# Altium schematic sheet OZ440-SE140-CAR001_sheet1.SchDoc: Carte securité: TOP LEVEL
size A3; Author: Bruno MATHIEU; CompanyName: NAIO TECHNOLOGIES; DrawnBy: Bruno MATHIEU; Engineer: Bruno MATHIEU; DocumentNumber: OZ440-SE140-CAR001-SHEET1; Revision: 1; SheetNumber: 1; SheetTotal: 6; CurrentDate: 27/11/14; DocumentName: Carte securité: TOP LEVEL
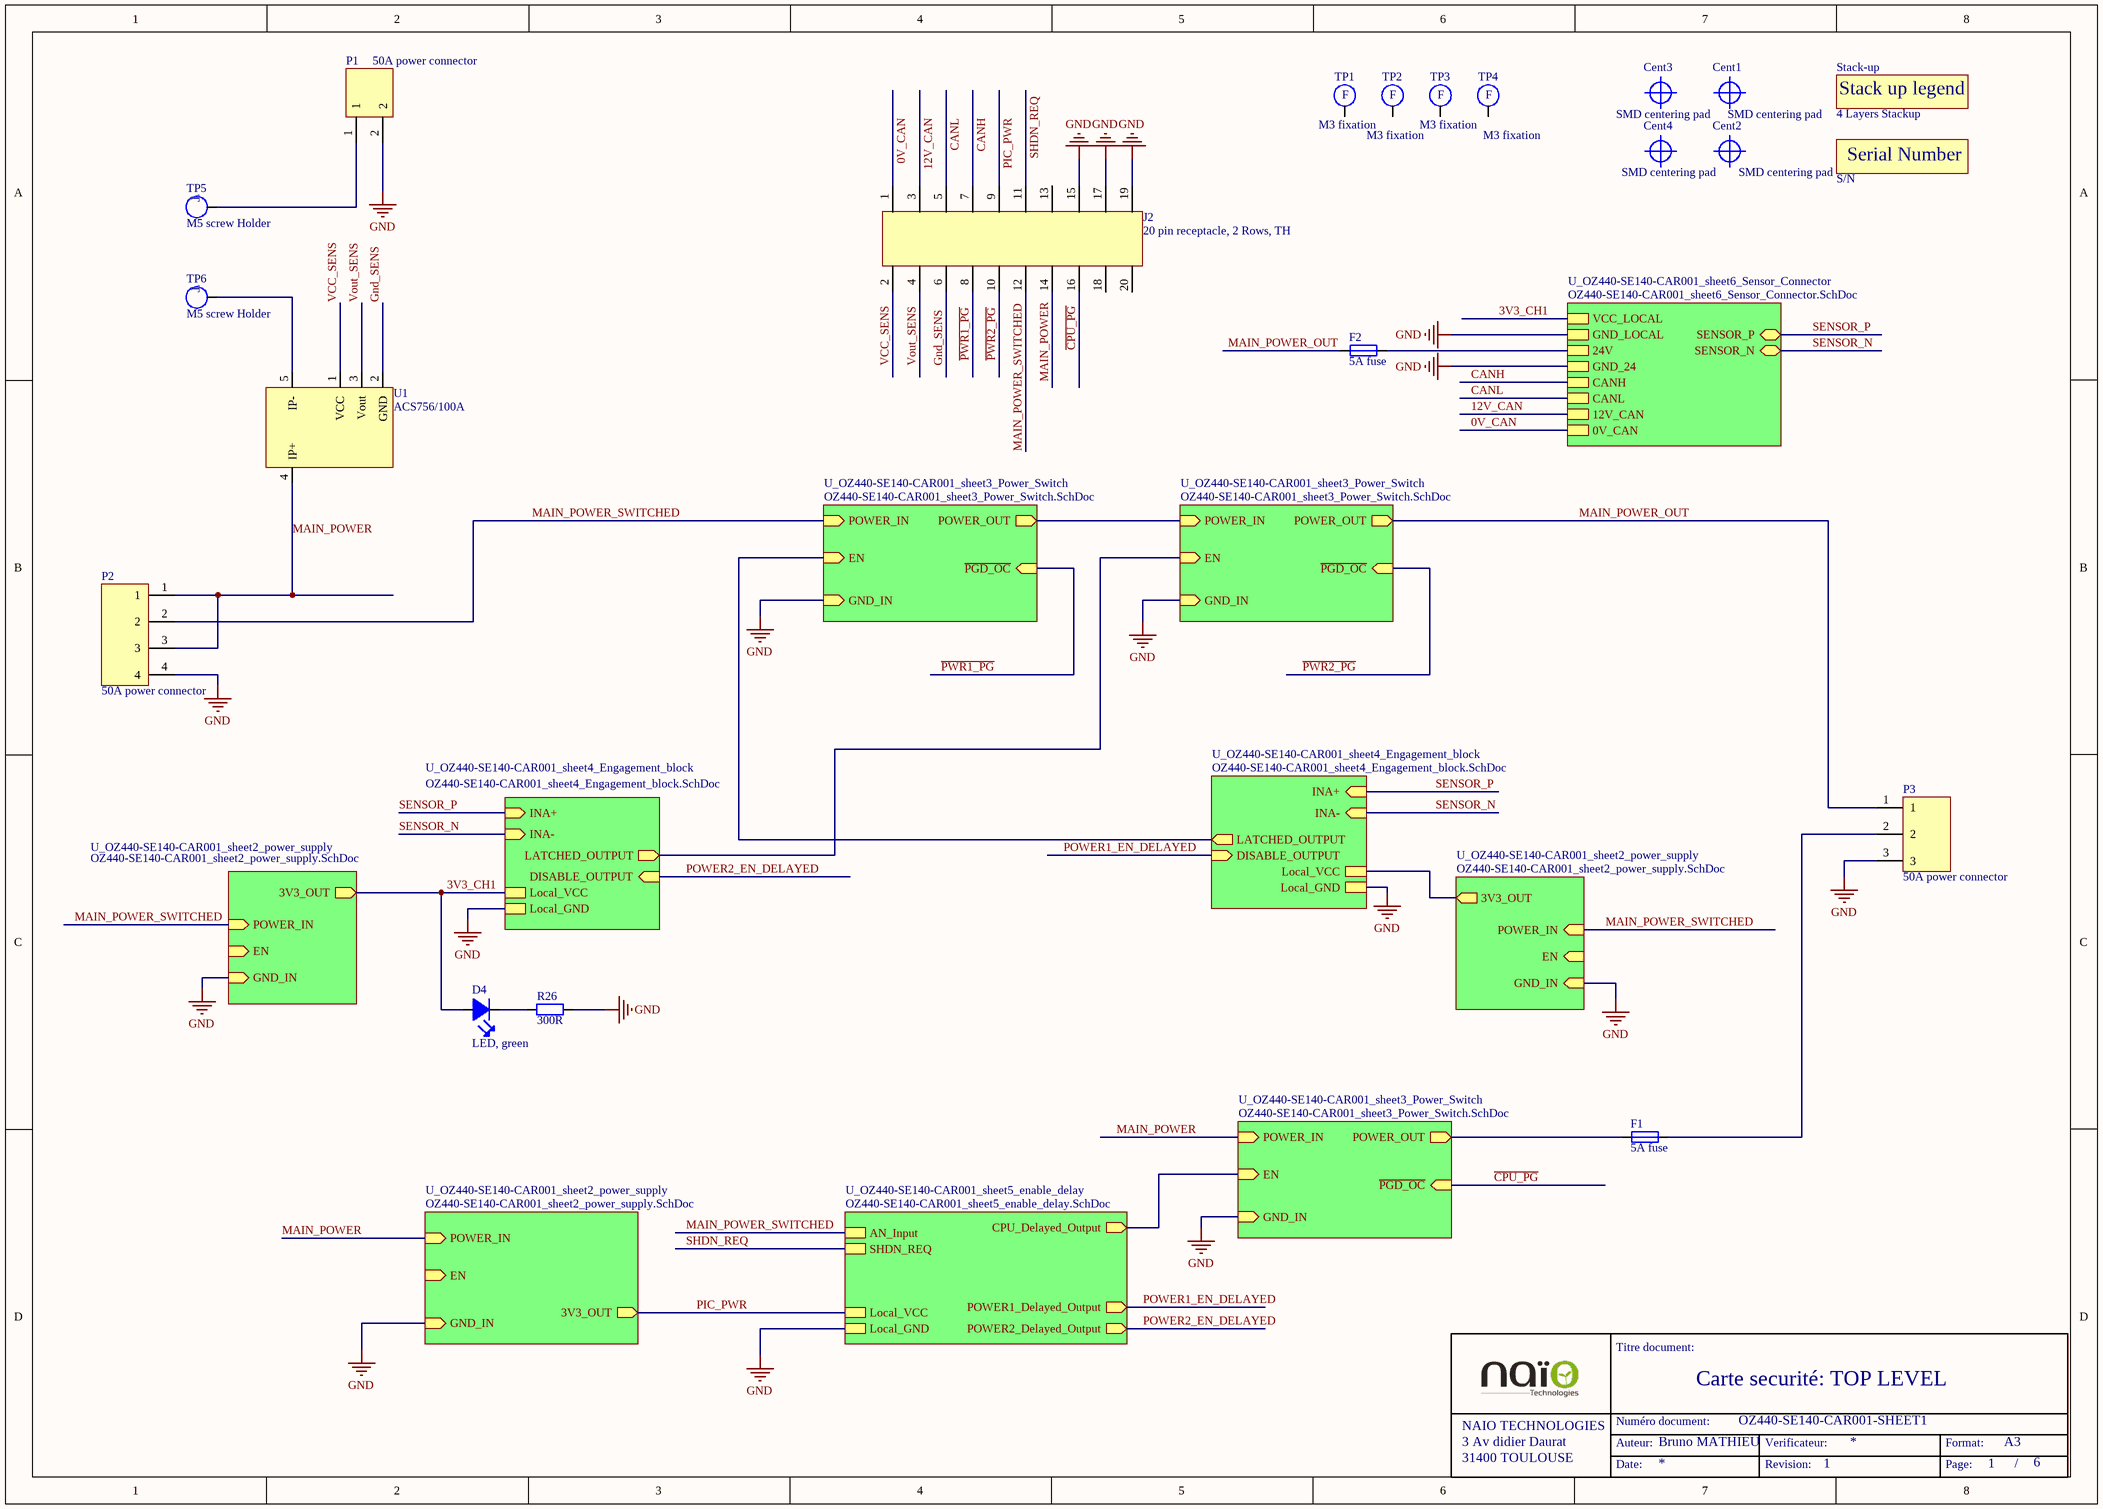
[diagram p0: OZ440-SE140-CAR001_sheet1.SchDoc]

## Parts
Cent1  MEC-STD-CENTER  [MEC-STD-CENTER]  (value not drawn)  (no BOM)
Cent2  MEC-STD-CENTER  [MEC-STD-CENTER]  (value not drawn)  (no BOM)
Cent3  MEC-STD-CENTER  [MEC-STD-CENTER]  (value not drawn)  (no BOM)
Cent4  MEC-STD-CENTER  [MEC-STD-CENTER]  (value not drawn)  (no BOM)
D4  Displayed reference: LED, green  [LED_3MM]  (hidden comment: LED)  (no BOM)
F1  Displayed reference: 5A fuse  [F-SPE-154Series_littlefuse]  (hidden comment: FUSE-SMD)
F2  Displayed reference: 5A fuse  [F-SPE-154Series_littlefuse]  (hidden comment: FUSE-SMD)
J2  Displayed reference: 20 pin receptacle, 2 Rows, TH  [CONN-SPE_ESQ-110-12-G-D]  (hidden comment: CONN-STD-20P_2ROW)
P1  Displayed reference: 50A power connector  [CONN-SPE-428192213_MOLEX]  (hidden comment: CONN-STD-2P_puissance)
P2  Displayed reference: 50A power connector  [CONN-SPE-428194213_MOLEX]  (hidden comment: CONN-STD-4P_puissance)
P3  Displayed reference: 50A power connector  [CONN-SPE-428193213_MOLEX]  (hidden comment: CONN-STD-3P_puissance)
R26  Displayed reference: 300R  [R0805-STD]  (hidden comment: RES-SMD)
SN  Displayed reference: S/N  [SERIAL_NUMBER-STD]  (hidden comment: SERIAL-NUMBER)  (no BOM)
Stack-up  Displayed reference: 4 Layers Stackup  [STACKUP-SPE-4LAYERS]  (hidden comment: STACKUP)  (no BOM)
TP1  Displayed reference: M3 fixation  [MEC-STD-FIX_M3]  (hidden comment: FIX-STD-PCB_FIXATION)  (no BOM)
TP2  Displayed reference: M3 fixation  [MEC-STD-FIX_M3]  (hidden comment: FIX-STD-PCB_FIXATION)  (no BOM)
TP3  Displayed reference: M3 fixation  [MEC-STD-FIX_M3]  (hidden comment: FIX-STD-PCB_FIXATION)  (no BOM)
TP4  Displayed reference: M3 fixation  [MEC-STD-FIX_M3]  (hidden comment: FIX-STD-PCB_FIXATION)  (no BOM)
TP5  Displayed reference: M5 screw Holder  [MEC-SPE-WURTHZ_7460408]  (hidden comment: TP-STD-TEST_POINT)
TP6  Displayed reference: M5 screw Holder  [MEC-SPE-WURTHZ_7460408]  (hidden comment: TP-STD-TEST_POINT)
U1  Displayed reference: ACS756/100A  [CA_PFF-SPE-ACS756]  (hidden comment: ACS756-CA_PFF)

## Sub-sheets
U_OZ440-SE140-CAR001_sheet2_power_supply = OZ440-SE140-CAR001_sheet2_power_supply.SchDoc: EN (in), POWER_IN (in), GND_IN (in), 3V3_OUT (out)
U_OZ440-SE140-CAR001_sheet2_power_supply = OZ440-SE140-CAR001_sheet2_power_supply.SchDoc: EN (in), POWER_IN (in), GND_IN (in), 3V3_OUT (out)
U_OZ440-SE140-CAR001_sheet2_power_supply = OZ440-SE140-CAR001_sheet2_power_supply.SchDoc: EN (in), POWER_IN (in), GND_IN (in), 3V3_OUT (out)
U_OZ440-SE140-CAR001_sheet3_Power_Switch = OZ440-SE140-CAR001_sheet3_Power_Switch.SchDoc: POWER_IN (in), GND_IN (in), EN (in), POWER_OUT (out), ~{PGD_OC} (in)
U_OZ440-SE140-CAR001_sheet3_Power_Switch = OZ440-SE140-CAR001_sheet3_Power_Switch.SchDoc: POWER_IN (in), GND_IN (in), EN (in), POWER_OUT (out), ~{PGD_OC} (in)
U_OZ440-SE140-CAR001_sheet3_Power_Switch = OZ440-SE140-CAR001_sheet3_Power_Switch.SchDoc: POWER_IN (in), GND_IN (in), EN (in), POWER_OUT (out), ~{PGD_OC} (in)
U_OZ440-SE140-CAR001_sheet4_Engagement_block = OZ440-SE140-CAR001_sheet4_Engagement_block.SchDoc: LATCHED_OUTPUT (out), Local_VCC, Local_GND, INA+ (in), INA- (in), DISABLE_OUTPUT (in)
U_OZ440-SE140-CAR001_sheet4_Engagement_block = OZ440-SE140-CAR001_sheet4_Engagement_block.SchDoc: LATCHED_OUTPUT (out), Local_VCC, Local_GND, INA+ (in), INA- (in), DISABLE_OUTPUT (in)
U_OZ440-SE140-CAR001_sheet5_enable_delay = OZ440-SE140-CAR001_sheet5_enable_delay.SchDoc: Local_VCC, Local_GND, AN_Input, CPU_Delayed_Output (out), SHDN_REQ, POWER1_Delayed_Output (out), POWER2_Delayed_Output (out)
U_OZ440-SE140-CAR001_sheet6_Sensor_Connector = OZ440-SE140-CAR001_sheet6_Sensor_Connector.SchDoc: VCC_LOCAL, GND_LOCAL, 24V, GND_24, CANH, CANL, 12V_CAN, 0V_CAN, SENSOR_P, SENSOR_N

## Nets
GND: J2.15 J2.17 J2.19 P1.2 P2.4 P3.3 R26.1 ; sheet U_OZ440-SE140-CAR001_sheet2_power_supply/GND_IN, sheet U_OZ440-SE140-CAR001_sheet2_power_supply/GND_IN, sheet U_OZ440-SE140-CAR001_sheet3_Power_Switch/GND_IN, sheet U_OZ440-SE140-CAR001_sheet3_Power_Switch/GND_IN, sheet U_OZ440-SE140-CAR001_sheet4_Engagement_block/Local_GND, sheet U_OZ440-SE140-CAR001_sheet4_Engagement_block/Local_GND, sheet U_OZ440-SE140-CAR001_sheet2_power_supply/GND_IN, sheet U_OZ440-SE140-CAR001_sheet5_enable_delay/Local_GND, sheet U_OZ440-SE140-CAR001_sheet3_Power_Switch/GND_IN, sheet U_OZ440-SE140-CAR001_sheet6_Sensor_Connector/GND_LOCAL, sheet U_OZ440-SE140-CAR001_sheet6_Sensor_Connector/GND_24
0V_CAN: J2.1 ; sheet U_OZ440-SE140-CAR001_sheet6_Sensor_Connector/0V_CAN
3V3_CH1: D4.1(A) ; sheet U_OZ440-SE140-CAR001_sheet4_Engagement_block/Local_VCC, sheet U_OZ440-SE140-CAR001_sheet2_power_supply/3V3_OUT, sheet U_OZ440-SE140-CAR001_sheet6_Sensor_Connector/VCC_LOCAL
12V_CAN: J2.3 ; sheet U_OZ440-SE140-CAR001_sheet6_Sensor_Connector/12V_CAN
~{CPU_PG}: J2.16 ; sheet U_OZ440-SE140-CAR001_sheet3_Power_Switch/~{PGD_OC}
~{PWR1_PG}: J2.8 ; sheet U_OZ440-SE140-CAR001_sheet3_Power_Switch/~{PGD_OC}
~{PWR2_PG}: J2.10 ; sheet U_OZ440-SE140-CAR001_sheet3_Power_Switch/~{PGD_OC}
CANH: J2.7 ; sheet U_OZ440-SE140-CAR001_sheet6_Sensor_Connector/CANH
CANL: J2.5 ; sheet U_OZ440-SE140-CAR001_sheet6_Sensor_Connector/CANL
Gnd_SENS: J2.6 U1.2(GND)
MAIN_POWER: J2.14 P2.1 P2.3 U1.4(IP+) ; sheet U_OZ440-SE140-CAR001_sheet2_power_supply/POWER_IN, sheet U_OZ440-SE140-CAR001_sheet3_Power_Switch/POWER_IN
MAIN_POWER_OUT: F2.1 P3.1 ; sheet U_OZ440-SE140-CAR001_sheet3_Power_Switch/POWER_OUT
MAIN_POWER_SWITCHED: J2.12 P2.2 ; sheet U_OZ440-SE140-CAR001_sheet2_power_supply/POWER_IN, sheet U_OZ440-SE140-CAR001_sheet3_Power_Switch/POWER_IN, sheet U_OZ440-SE140-CAR001_sheet2_power_supply/POWER_IN, sheet U_OZ440-SE140-CAR001_sheet5_enable_delay/AN_Input
PIC_PWR: J2.9 ; sheet U_OZ440-SE140-CAR001_sheet2_power_supply/3V3_OUT, sheet U_OZ440-SE140-CAR001_sheet5_enable_delay/Local_VCC
POWER1_EN_DELAYED: sheet U_OZ440-SE140-CAR001_sheet4_Engagement_block/DISABLE_OUTPUT, sheet U_OZ440-SE140-CAR001_sheet5_enable_delay/POWER1_Delayed_Output
POWER2_EN_DELAYED: sheet U_OZ440-SE140-CAR001_sheet4_Engagement_block/DISABLE_OUTPUT, sheet U_OZ440-SE140-CAR001_sheet5_enable_delay/POWER2_Delayed_Output
SENSOR_N: sheet U_OZ440-SE140-CAR001_sheet4_Engagement_block/INA-, sheet U_OZ440-SE140-CAR001_sheet4_Engagement_block/INA-, sheet U_OZ440-SE140-CAR001_sheet6_Sensor_Connector/SENSOR_N
SENSOR_P: sheet U_OZ440-SE140-CAR001_sheet4_Engagement_block/INA+, sheet U_OZ440-SE140-CAR001_sheet4_Engagement_block/INA+, sheet U_OZ440-SE140-CAR001_sheet6_Sensor_Connector/SENSOR_P
SHDN_REQ: J2.11 ; sheet U_OZ440-SE140-CAR001_sheet5_enable_delay/SHDN_REQ
VCC_SENS: J2.2 U1.1(VCC)
Vout_SENS: J2.4 U1.3(Vout)
NetD4_2: D4.2 R26.2
NetF1_1: F1.1 ; sheet U_OZ440-SE140-CAR001_sheet3_Power_Switch/POWER_OUT
NetF1_2: F1.2 P3.2
NetF2_2: F2.2 ; sheet U_OZ440-SE140-CAR001_sheet6_Sensor_Connector/24V
NetP1_1: P1.1 TP5.1(T)
NetTP6_1: TP6.1(T) U1.5(IP-)
(unnamed): sheet U_OZ440-SE140-CAR001_sheet2_power_supply/3V3_OUT, sheet U_OZ440-SE140-CAR001_sheet4_Engagement_block/Local_VCC
(unnamed): sheet U_OZ440-SE140-CAR001_sheet3_Power_Switch/EN, sheet U_OZ440-SE140-CAR001_sheet4_Engagement_block/LATCHED_OUTPUT
(unnamed): sheet U_OZ440-SE140-CAR001_sheet3_Power_Switch/POWER_OUT, sheet U_OZ440-SE140-CAR001_sheet3_Power_Switch/POWER_IN
(unnamed): sheet U_OZ440-SE140-CAR001_sheet3_Power_Switch/EN, sheet U_OZ440-SE140-CAR001_sheet4_Engagement_block/LATCHED_OUTPUT
(unnamed): sheet U_OZ440-SE140-CAR001_sheet5_enable_delay/CPU_Delayed_Output, sheet U_OZ440-SE140-CAR001_sheet3_Power_Switch/EN

Not connected (* = marked no-connect by the designer): J2 13 18 20; TP1 1(T); TP2 1(T); TP3 1(T); TP4 1(T)

## Notes on the sheet
- Titre document:
- NAIO TECHNOLOGIES
- 3 Av didier Daurat
- 31400 TOULOUSE
- Auteur:
- Numéro document:
- Verificateur:
- Format:
- A3
- Date:
- Revision:
- Page:
- /
- (in symbol 4 Layers Stackup) Stack up legend
- (in symbol M3 Fixation) F

## Library data of the parts
Cent1-Cent4 = SMD centering pad: Validated: False; Reference: SMD centering pad; Displayed reference: SMD centering pad
D4 = L-934GD: LED 3mm green TH; Manufacturer: Kingbright; Max Current: 20mA; Validated: False; Reference: L-934GD; Footprint description: TH 2.54mm pitch; Pin Count: 2; Rev: V.8; helpURL: http://www.farnell.com/datasheets/67148.pdf; Supplier 1: Farnell; Supplier Part Number 1: 1142502
F1 F2 = 0154005.DRT: 5A T fuse with SMD holder; Manufacturer: LITTLEFUSE; Max Voltage: 125V; Validated: False; Reference: 0154005.DRT; Max Current: 5A; Pin Count: 2; Rev: 3/10/14; helpURL: http://www.farnell.com/datasheets/1840330.pdf; Supplier 1: Farnell; Supplier Part Number 1: 2452874; Supplier 2: Mouser; Supplier Part Number 2: 576-0154005.DRTL
J2 = ESQ-110-12-G-D: 20 pin receptacle, 2.54mm, TH; Manufacturer: SAMTEC; Validated: False; Reference: ESQ-110-12-G-D; Footprint description: 20 pin receptacle, TH; Pin Count: 20; helpURL: https://www.samtec.com/technical-specifications/Default.aspx?SeriesMaster=ESQ; Supplier 1: Farnell; Supplier Part Number 1: 1769167
P1 = 42819-2213: 2 pin power connector, ST; Manufacturer: Molex; Max Voltage: 600V; Max Current: 50A; Validated: False; Reference: 42819-2213; Footprint description: Thu hole 10mm pitch; Pin Count: 2; Rev: E6; helpURL: http://www.molex.com/pdm_docs/sd/428192213_sd.pdf; Supplier 1: Newark; Supplier Part Number 1: 61H8951; Supplier 2: Mouser; Supplier Part Number 2: 538-42819-2213
P2 = 42819-4213: 4 pin power connector; Manufacturer: Molex; Max Voltage: 600V; Max Current: 50A; Validated: False; Reference: 42819-4213; Footprint description: Thu hole 10mm pitch; Pin Count: 4; Rev: E6; helpURL: http://www.molex.com/pdm_docs/sd/428194213_sd.pdf; Supplier 1: Mouser; Supplier Part Number 1: 538-42819-4213; Supplier 2: Newark; Supplier Part Number 2: 92M0969
P3 = 42819-3213: 3 pin power connector, ST; Manufacturer: Molex; Max Voltage: 600V; Max Current: 50A; Validated: False; Reference: 42819-3213; Footprint description: Thu hole 10mm pitch; Pin Count: 3; Rev: E6; helpURL: http://www.molex.com/pdm_docs/sd/428193213_sd.pdf; Supplier 1: Mouser; Supplier Part Number 1: 538-42819-3213; Supplier 2: Farnell; Supplier Part Number 2: 2334074
R26 = CRCW0805300RFKxx: 300 ohm 0805 SMD resistor; Manufacturer: Vishay; Value: 300; Tolerance: 1%; Rated Power: 0.125W; Validated: No; Reference: CRCW0805300RFKxx; Footprint description: standard 0805 SMD; Pin Count: 2; helpURL: http://www.vishay.com/docs/20035/dcrcwe3.pdf; Supplier 1: Mouser; Supplier Part Number 1: 71-CRCW0805300RFKEA; Supplier 2: Farnell; Supplier Part Number 2: 1152346
SN = Serial Number: serial number copper identification; Validated: False; Reference: Serial Number
Stack-up = 4 Layers Stackup: 4 Layers Stackup identification; Validated: False; Reference: 4 Layers Stackup
TP1-TP4 = M3 Fixation: M3 Hole for Board fixation; Validated: False; Reference: M3 Fixation
TP5 TP6 = 7460408: Bush with threaded hole M5; Manufacturer: WURTHZ; Max Current: 160A; Validated: False; Reference: 7460408; Material: CuZn39Pb3; Footprint description: Pressfit Bush with threaded hole M5; Pin Count: 1; helpURL: http://katalog.we-online.de/em/datasheet/7460408.pdf; Supplier 1: Farnell; Supplier Part Number 1: 1821279; Supplier 2: Mouser; Supplier Part Number 2: 710-7460408
U1 = ACS756SCA-100B-PFF-T: +/- 100A Linear Current Sensor IC; Manufacturer: Allegro; Max Voltage: 5; Frequency band: 100kHz; Gain: 40mV/A; Validated: False; Reference: ACS756SCA-100B-PFF-T; Max Current: 100A; Footprint description: CA_PFF specific; Pin Count: 5; Rev: 6; helpURL: http://www.allegromicro.com/~/media/Files/Datasheets/ACS756-Datasheet.ashx; Supplier 1: Farnell; Supplier Part Number 1: 2112638; Supplier 2: Digi-Key; Supplier Part Number 2: 620-1238-ND